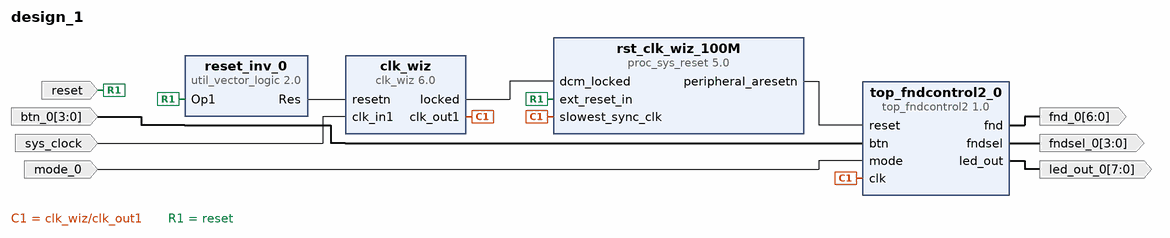
[diagram p0: block diagram of the top level]
# Vivado block design design_1, xc7a35tcpg236-1, Vivado 2023.2
create_bd_design design_1

create_bd_port -dir I -from 3 -to 0 btn_0
create_bd_port -dir O -from 6 -to 0 fnd_0
create_bd_port -dir O -from 3 -to 0 fndsel_0
create_bd_port -dir O -from 7 -to 0 led_out_0
create_bd_port -dir I mode_0
create_bd_port -dir I -type clk sys_clock
set_property -dict {CONFIG.FREQ_HZ 100000000 CONFIG.PHASE 0.0} [get_bd_ports sys_clock]
create_bd_port -dir I -type rst reset
set_property -dict {CONFIG.POLARITY ACTIVE_HIGH} [get_bd_ports reset]

create_bd_cell -type ip -vlnv xilinx.com:user:top_fndcontrol2:1.0 top_fndcontrol2_0
create_bd_cell -type ip -vlnv xilinx.com:ip:clk_wiz:6.0 clk_wiz
set_property -dict [list \
  CONFIG.CLK_IN1_BOARD_INTERFACE sys_clock \
  CONFIG.RESET_BOARD_INTERFACE reset \
  CONFIG.RESET_PORT resetn \
  CONFIG.RESET_TYPE ACTIVE_LOW \
  CONFIG.USE_BOARD_FLOW true \
] [get_bd_cells clk_wiz]
create_bd_cell -type ip -vlnv xilinx.com:ip:proc_sys_reset:5.0 rst_clk_wiz_100M
set_property -dict {CONFIG.RESET_BOARD_INTERFACE reset CONFIG.USE_BOARD_FLOW true} [get_bd_cells rst_clk_wiz_100M]
create_bd_cell -type ip -vlnv xilinx.com:ip:util_vector_logic:2.0 reset_inv_0
set_property -dict {CONFIG.C_OPERATION not CONFIG.C_SIZE 1} [get_bd_cells reset_inv_0]

# ---- connections ----

connect_bd_net -net btn_0_1 [get_bd_ports btn_0] [get_bd_pins top_fndcontrol2_0/btn]
connect_bd_net [get_bd_pins clk_wiz/clk_out1] [get_bd_pins top_fndcontrol2_0/clk] [get_bd_pins rst_clk_wiz_100M/slowest_sync_clk]
connect_bd_net [get_bd_pins clk_wiz/locked] [get_bd_pins rst_clk_wiz_100M/dcm_locked]
connect_bd_net -net mode_0_1 [get_bd_ports mode_0] [get_bd_pins top_fndcontrol2_0/mode]
connect_bd_net [get_bd_ports reset] [get_bd_pins rst_clk_wiz_100M/ext_reset_in] [get_bd_pins reset_inv_0/Op1]
connect_bd_net [get_bd_pins reset_inv_0/Res] [get_bd_pins clk_wiz/resetn]
connect_bd_net [get_bd_pins rst_clk_wiz_100M/peripheral_aresetn] [get_bd_pins top_fndcontrol2_0/reset]
connect_bd_net [get_bd_ports sys_clock] [get_bd_pins clk_wiz/clk_in1]
connect_bd_net [get_bd_pins top_fndcontrol2_0/fnd] [get_bd_ports fnd_0]
connect_bd_net [get_bd_pins top_fndcontrol2_0/fndsel] [get_bd_ports fndsel_0]
connect_bd_net [get_bd_pins top_fndcontrol2_0/led_out] [get_bd_ports led_out_0]

validate_bd_design
save_bd_design
